# EAGLE design CAN-Bus_Shield_v1.2 (EAGLE 6.5.0)
DESCRIPTION: microOBD 200 OBD-II Module; HW_REV: 1.4; PCB_REV: C; PCB_SPEC1: Layer Count: 4; PCB_SPEC2: Size: 1.3" x 0.59"; PCB_SPEC3: Finish Thickness: 0.049" - 0.052"; PCB_SPEC4: Copper Weight: 1oz; TITLE: STM1120
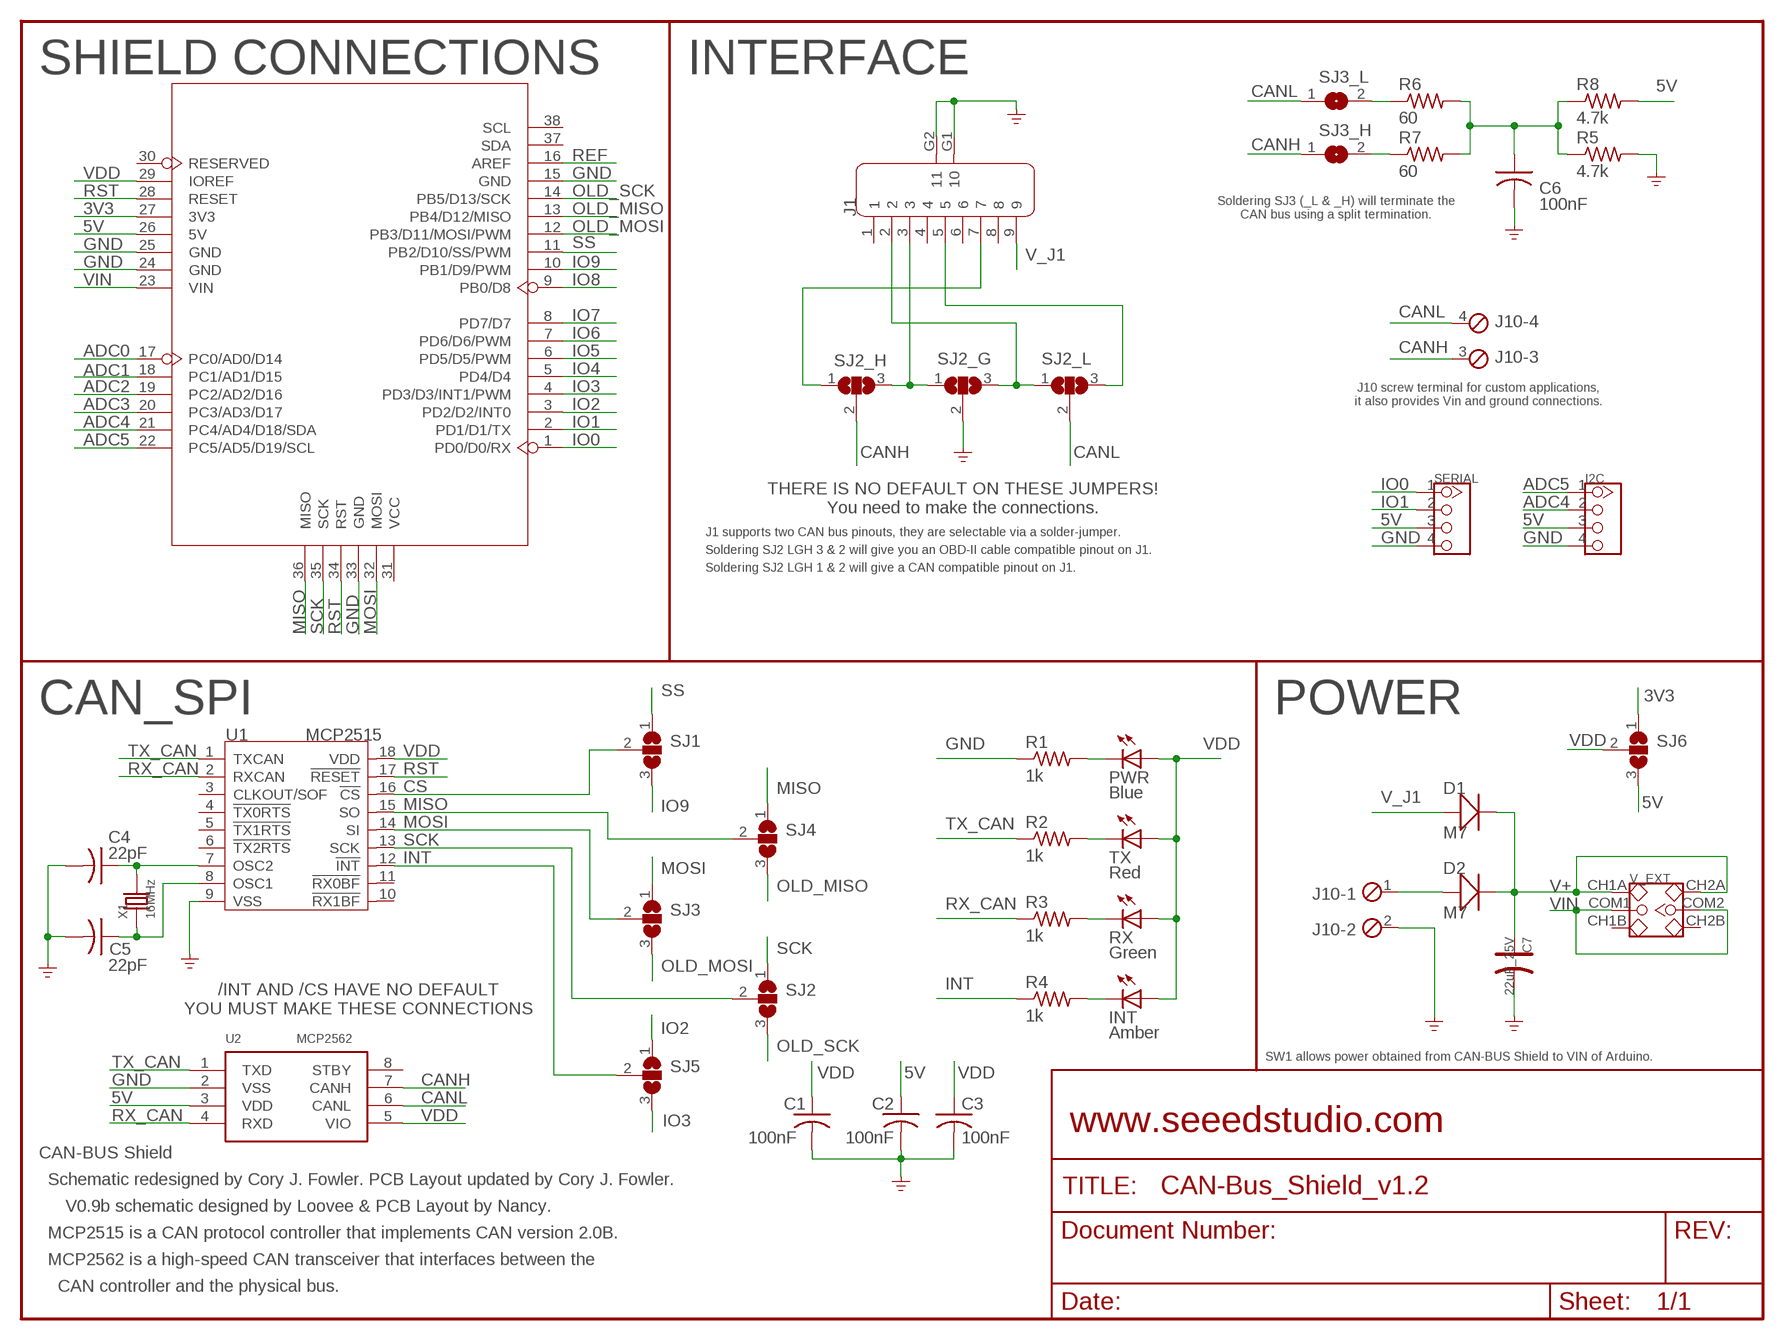
[diagram p0: schematic, sheet 1]

## Parts
C1  100nF  C-USC0603K  [C0603K]
C2  100nF  C-USC0603K  [C0603K]
C3  100nF  C-USC0603K  [C0603K]
C4  22pF  C-USC0603  [C0603]
C5  22pF  C-USC0603  [C0603]
C6  100nF  C-USC1210  [C1210]
C7  22uF_25V  CAP-AVX-C  [AVX-C]
D1  M7  D-SMA  [D2010]
D2  M7  D-SMA  [D2010]
I2C  TWIG-4P-2.0-2.0  [4P-2.0]
INT  Amber  LEDCHIP-LED0805  [CHIP-LED0805]
J1  DB9'MEAL'  [DB9-MEAL]
J10  MPT4  [4POL254]
PWR  Blue  LEDCHIP-LED0805  [CHIP-LED0805]
R1  1k  R-US_M0805  [M0805]
R2  1k  R-US_M0805  [M0805]
R3  1k  R-US_M0805  [M0805]
R4  1k  R-US_M0805  [M0805]
R5  4.7k  R-US_M3216  [M3216]
R6  60  R-US_M3216  [M3216]
R7  60  R-US_M3216  [M3216]
R8  4.7k  R-US_M3216  [M3216]
RX  Green  LEDCHIP-LED0805  [CHIP-LED0805]
SERIAL  TWIG-4P-2.0-2.0  [4P-2.0]
SJ1  SJ2W  [SJ_2]
SJ2  SJ2W  [SJ_2]
SJ2_G  SJ2W  [SJ_2]
SJ2_H  SJ2W  [SJ_2]
SJ2_L  SJ2W  [SJ_2]
SJ3  SJ2W  [SJ_2]
SJ3_H  SJ  [SJ]
SJ3_L  SJ  [SJ]
SJ4  SJ2W  [SJ_2]
SJ5  SJ2W  [SJ_2]
SJ6  SJ2W  [SJ_2]
TX  Red  LEDCHIP-LED0805  [CHIP-LED0805]
U1  MCP2515  [SOIC18]
U2  MCP2562  [SO08]
U3  ARDUINO  [ARDUINO]
V_EXT  SWITCH-2CH-6P  [6P-2CH-2.54-7.6X3.0]
X1  16MHz  CRYSTAL-HC49S  [HC49/S]

## Nets
3V3: SJ6.1 U3.27(3V3)
5V: C2.1 I2C.3 R8.2 SERIAL.3 SJ6.3 U2.3(VDD) U3.26(5V)
ADC0: U3.17(PC0/AD0/D14)
ADC1: U3.18(PC1/AD1/D15)
ADC2: U3.19(PC2/AD2/D16)
ADC3: U3.20(PC3/AD3/D17)
ADC4: I2C.2 U3.21(PC4/AD4/D18/SDA)
ADC5: I2C.1 U3.22(PC5/AD5/D19/SCL)
CANH: J10.3 SJ2_H.2 SJ3_H.1 U2.7(CANH)
CANL: J10.4 SJ2_L.2 SJ3_L.1 U2.6(CANL)
CS: SJ1.2 U1.16(!CS)
GND: C1.2 C2.2 C3.2 C4.2 C5.2 C6.2 C7.- I2C.4 J1.G1 J1.G2 J10.2 R1.1 R5.2 SERIAL.4 SJ2_G.2 U1.9(VSS) U2.2(VSS) U3.15(GND) U3.24(GND) U3.25(GND) U3.33(GND)
INT: R4.1 SJ5.2 U1.12(!INT)
IO0: SERIAL.1 U3.1(PD0/D0/RX)
IO1: SERIAL.2 U3.2(PD1/D1/TX)
IO2: SJ5.1 U3.3(PD2/D2/INT0)
IO3: SJ5.3 U3.4(PD3/D3/INT1/PWM)
IO4: U3.5(PD4/D4)
IO5: U3.6(PD5/D5/PWM)
IO6: U3.7(PD6/D6/PWM)
IO7: U3.8(PD7/D7)
IO8: U3.9(PB0/D8)
IO9: SJ1.3 U3.10(PB1/D9/PWM)
MISO: SJ4.1 SJ4.2 U1.15(SO) U3.36(MISO)
MOSI: SJ3.1 SJ3.2 U1.14(SI) U3.32(MOSI)
N$1: PWR.C R1.2
N$2: R2.2 TX.C
N$3: R3.2 RX.C
N$4: J1.2 SJ2_G.3 SJ2_L.1
N$5: J1.7 SJ2_H.1
N$6: J1.3 SJ2_G.1 SJ2_H.3
N$8: R6.1 SJ3_L.2
N$9: R7.1 SJ3_H.2
N$10: C6.1 R5.1 R6.2 R7.2 R8.1
N$13: C5.1 U1.8(OSC1) X1.1
N$14: C4.1 U1.7(OSC2) X1.2
N$15: INT.C R4.2
N$17: J1.5 SJ2_L.3
OLD_MISO: SJ4.3 U3.13(PB4/D12/MISO)
OLD_MOSI: SJ3.3 U3.12(PB3/D11/MOSI/PWM)
OLD_SCK: SJ2.3 U3.14(PB5/D13/SCK)
REF: U3.16(AREF)
RST: U1.17(!RESET) U3.28(RESET) U3.34(RST)
RX_CAN: R3.1 U1.2(RXCAN) U2.4(RXD)
SCK: SJ2.1 SJ2.2 U1.13(SCK) U3.35(SCK)
SS: SJ1.1 U3.11(PB2/D10/SS/PWM)
TX_CAN: R2.1 U1.1(TXCAN) U2.1(TXD)
V+: C7.+ D1.- D2.- V_EXT.CH1A V_EXT.CH2A
V_J1: D1.+ J1.9
V_J10: D2.+ J10.1
VDD: C1.1 C3.1 INT.A PWR.A RX.A SJ6.2 TX.A U1.18(VDD) U2.5(VIO) U3.29(IOREF)
VIN: U3.23(VIN) V_EXT.COM1 V_EXT.COM2
Unconnected: J1.1 J1.4 J1.6 J1.8 U1.3(CLKOUT/SOF) U1.4(!TX0RTS) U1.5(!TX1RTS) U1.6(!TX2RTS) U1.10(!RX1BF) U1.11(!RX0BF) U2.8(STBY) U3.30(RESERVED) U3.31(VCC) U3.37(SDA) U3.38(SCL) V_EXT.CH1B V_EXT.CH2B

## Notes on the sheet
- SHIELD CONNECTIONS | INTERFACE
- Soldering SJ3 (_L & _H) will terminate the
  CAN bus using a split termination.
- J10 screw terminal for custom applications,
  it also provides Vin and ground connections.
- THERE IS NO DEFAULT ON THESE JUMPERS!
  You need to make the connections.
- J1 supports two CAN bus pinouts, they are selectable via a solder-jumper.
- Soldering SJ2 LGH 3 & 2 will give you an OBD-II cable compatible pinout on J1.
- Soldering SJ2 LGH 1 & 2 will give a CAN compatible pinout on J1.
- CAN_SPI | POWER
- /INT AND /CS HAVE NO DEFAULT
  YOU MUST MAKE THESE CONNECTIONS
- SW1 allows power obtained from CAN-BUS Shield to VIN of Arduino.
- www.seeedstudio.com
- CAN-BUS Shield
- Schematic redesigned by Cory J. Fowler. PCB Layout updated by Cory J. Fowler.
- V0.9b schematic designed by Loovee & PCB Layout by Nancy.
- MCP2515 is a CAN protocol controller that implements CAN version 2.0B.
- MCP2562 is a high-speed CAN transceiver that interfaces between the
- CAN controller and the physical bus.

## Library data of the parts
C1-C6 = resistor:C-US: CAPACITOR, American symbol
C7 = Discrete:CAP*: Electrolytic Capacitors,Tantalum Capacitors and Super Capacitors
D1 D2 = Discrete:D*
I2C SERIAL = Connector:TWIG-4P-2.0
INT PWR RX TX = led:LED: LED OSRAM: - CHIPLED LG R971, LG N971, LY N971, LG Q971, LY Q971, LO R971, LY R971 LH N974, LH R974 LS Q976, LO Q976, LY Q976 LO Q996 - Hyper CHIPLED LW Q18S LB Q993, LB Q99A, LB R99A - SideLED LS A670, LO A670, LY A670, LG A670, LP A670 LB A673, LV A673, LT A673, LW A673 LH A674 LY A675 LS A676, LA A676, LO A676, LY A676, LW A676 LS A679, LY A679, LG A679 - Hyper Micro SIDELED® LS Y876, LA Y876, LO Y876, LY Y876 LT Y87S - SmartLED LW L88C, LW L88S LB L89C, LB L89S, LG L890 LS L89K, LO L89K, LY L89K LS L896, LA L896, LO L896, LY L896 - TOPLED LS T670, LO T670, LY T670, LG T670, LP T670 LSG T670, LSP T670, LSY T670, LOP T670, LYG T670 LG T671, LOG T671, LSG T671 LB T673, LV T673, LT T673, LW T673 LH T674 LS T676, LA T676, LO T676, LY T676, LB T676, LH T676, LSB T676, LW T676 LB T67C, LV T67C, LT T67C, LS T67K, LO T67K, LY T67K, LW E67C LS E67B, LA E67B, LO E67B, LY E67B, LB E67C, LV E67C, LT E67C LW T67C LS T679, LY T679, LG T679 LS T770, LO T770, LY T770, LG T770, LP T770 LB T773, LV T773, LT T773, LW T773 LH T774 LS E675, LA E675, LY E675, LS T675 LS T776, LA T776, LO T776, LY T776, LB T776 LHGB T686 LT T68C, LB T68C - Hyper Mini TOPLED® LB M676 - Mini TOPLED Santana® LG M470 LS M47K, LO M47K, LY M47K Source: http://www.osram.convergy.de LUXEON: - LUMILED® LXK2-PW12-R00, LXK2-PW12-S00, LXK2-PW14-U00, LXK2-PW14-V00 LXK2-PM12-R00, LXK2-PM12-S00, LXK2-PM14-U00 LXK2-PE12-Q00, LXK2-PE12-R00, LXK2-PE12-S00, LXK2-PE14-T00, LXK2-PE14-U00 LXK2-PB12-K00, LXK2-PB12-L00, LXK2-PB12-M00, LXK2-PB14-N00, LXK2-PB14-P00, LXK2-PB14-Q00 LXK2-PR12-L00, LXK2-PR12-M00, LXK2-PR14-Q00, LXK2-PR14-R00 LXK2-PD12-Q00, LXK2-PD12-R00, LXK2-PD12-S00 LXK2-PH12-R00, LXK2-PH12-S00 LXK2-PL12-P00, LXK2-PL12-Q00, LXK2-PL12-R00 Source: www.luxeon.com KINGBRIGHT: KA-3528ASYC Source: www.kingbright.com
J1 = Connector:DB9
J10 = con-phoenix-254:MPT4: PHOENIX CONNECTOR; OC_FARNELL: unknown; OC_NEWARK: unknown
R1-R8 = resistor:R-US_: RESISTOR, American symbol
SJ1 SJ2 SJ2_G SJ2_H SJ2_L SJ3-SJ6 = jumper:SJ2W: SMD solder JUMPER
SJ3_H SJ3_L = jumper:SJ: SMD solder JUMPER
U1 = IC:MCP2515: Stand-Alone CAN Controller With SPI Interface
U2 = IC:MCP2562: High-Speed CAN Transceiver http://ww1.microchip.com/downloads/en/devicedoc/21667f.pdf
U3 = Module:ARDUINO
V_EXT = Discrete:SWITCH-2CH-6P
X1 = Discrete:CRYSTAL*: CRYSTAL

## Net classes
0 default: width 0.203 mm, drill 0.305 mm, clearance 0.203 mm

## Board
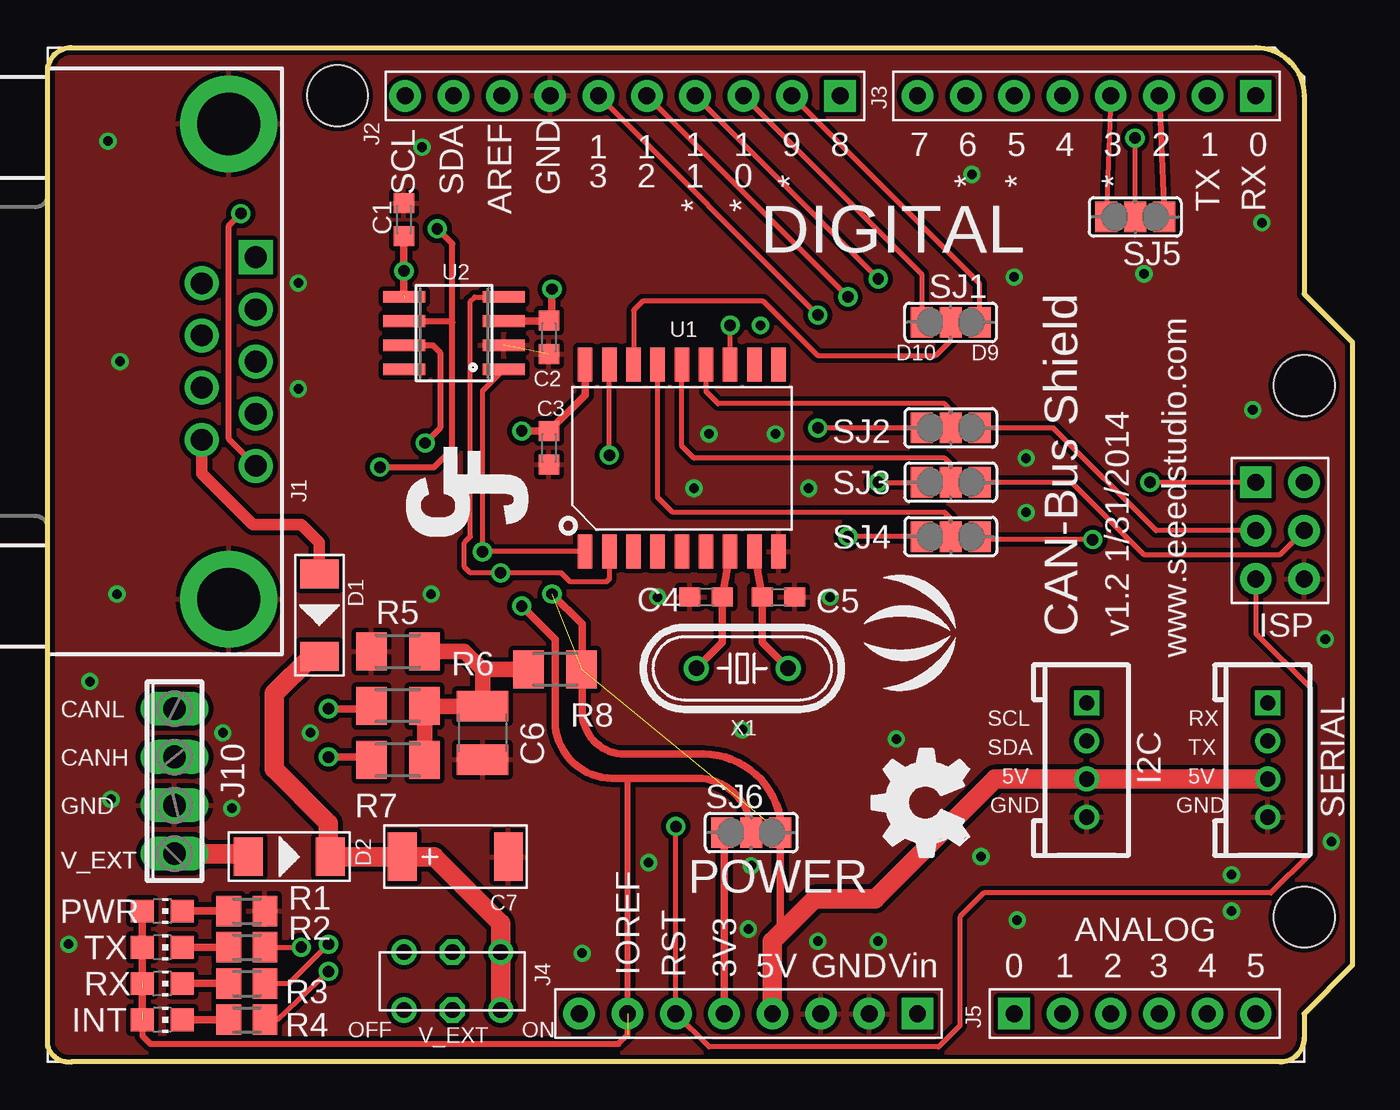
[diagram p1: board, top side]
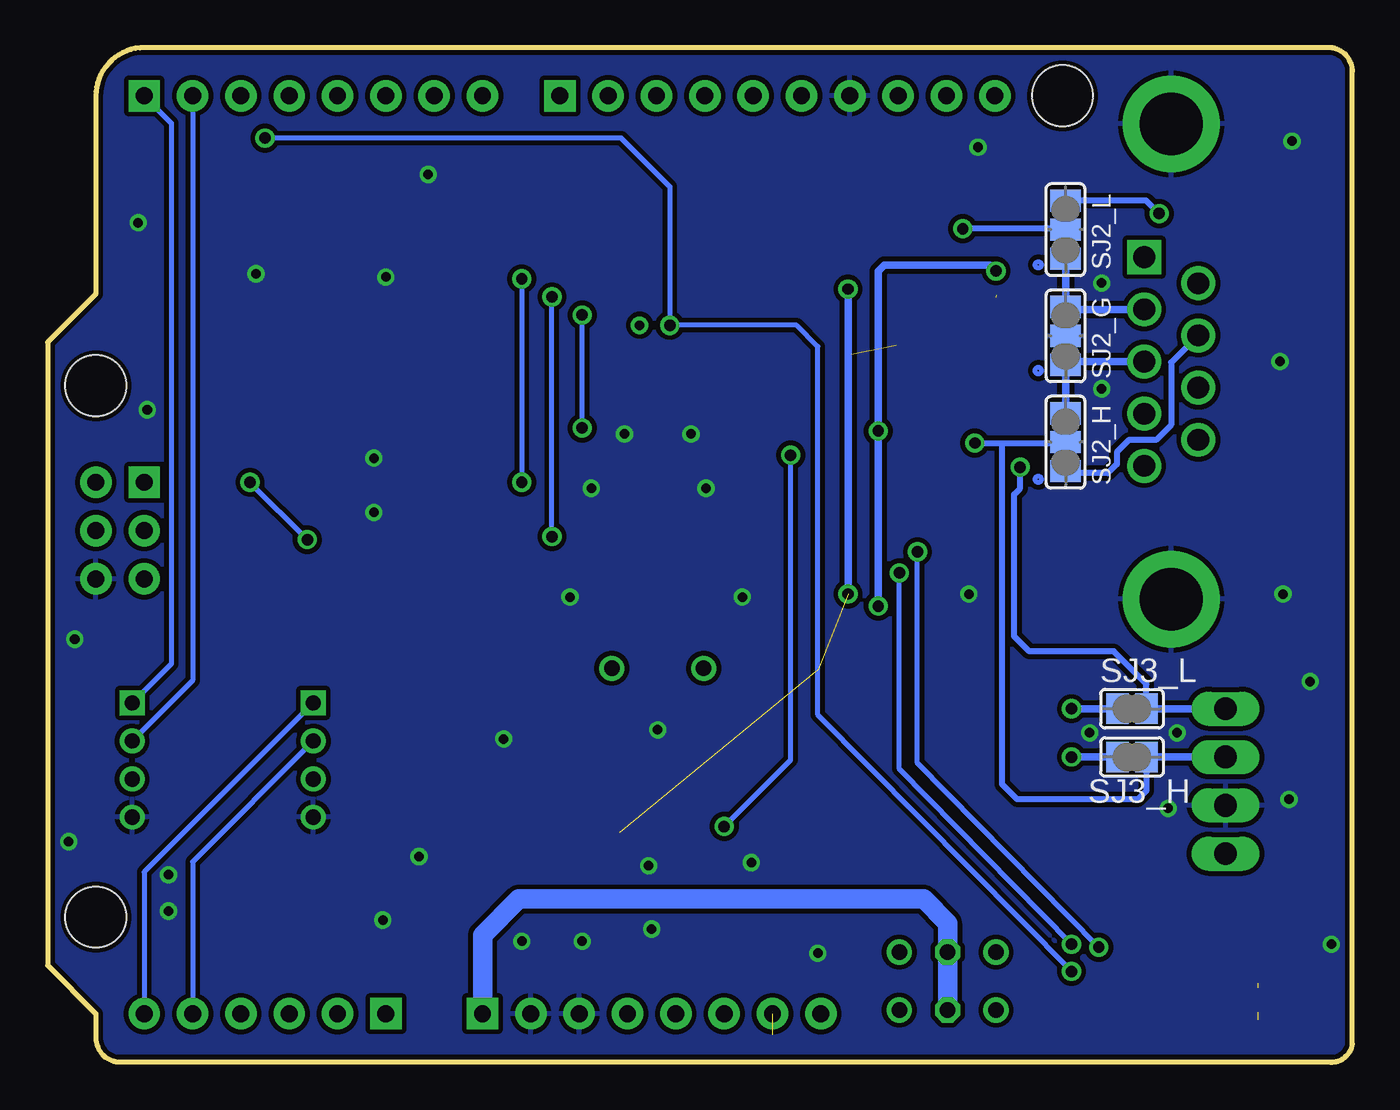
[diagram p2: board, bottom side, seen from below]

Size 68.58 x 53.35 mm. Coordinates in mm from the lower left corner, seen from the top.
Outline: 66.04,2.55 66.04,1.28 arc-90 64.77,0.01 1.27,0.01 arc-90 0,0.96 0,52.08 arc-90 1.27,53.35 63.5,53.35 arc-90 66.04,50.81 66.04,40.4 68.58,37.86 68.58,5.09 66.04,2.55
Copper layers (1*16): Top 0.035mm / dielectric 1.5mm / Bottom 0.035mm
Design rules "default": minimum track width 10mil, minimum drill 12mil, track to track 8mil, track to pad 8mil, pad to pad 8mil, via to via 8mil, smd to smd 8mil, copper to edge 10mil, drill to drill 8mil, minimum pad ring 10mil, minimum via ring 8mil, stop-mask expansion 4mil, vias tented up to drill 25mil, thermal gap 10mil

### Footprints (pad centres in the part's own frame; a part is rotated, then mirrored left to right if it is on the bottom)
C0603K = smd 1.05 x 1.08: 1 -0.875,0; 2 0.875,0
C0603 = smd 1.1 x 1: 1 -0.85,0; 2 0.85,0
C1210 = smd 1.6 x 2.7: 1 -1.4,0; 2 1.4,0
AVX-C = smd 1.524 x 2.54: + -2.794,0; - 2.794,0
D2010 = smd 1.524 x 2.032: + -2.159,0; - 2.159,0
4P-2.0 = drill 0.8 pad 1.27 square: 1 -3,0 | drill 0.8 pad 1.27: 2 -1,0; 3 1,0; 4 3,0
CHIP-LED0805 = smd 1.2 x 1.2: A 0,-1.05; C 0,1.05
DB9-MEAL = drill 1.143 pad 1.778 square: 1 -5.486,1.422 | drill 1.143 pad 1.778: 2 -2.743,1.422; 3 0,1.422; 4 2.743,1.422; 5 5.486,1.422; 6 -4.115,-1.422; 7 -1.372,-1.422; 8 1.372,-1.422; 9 4.115,-1.422 | drill 3.302 pad 5.08: G1 12.497,0; G2 -12.497,0
4POL254 = drill 1.2 long: 1 -3.81,0; 2 -1.27,0; 3 1.27,0; 4 3.81,0
M0805 = smd 1.3 x 1.6: 1 -0.95,0; 2 0.95,0
M3216 = smd 1.6 x 2: 1 -1.4,0; 2 1.4,0
SJ_2 = smd 1.168 x 1.6: 1 -1.524,0; 2 0,0; 3 1.524,0
SJ = smd 1.168 x 1.6: 1 -0.762,0; 2 0.762,0
SOIC18 = smd 0.762 x 1.778: 1 -5.08,-4.915; 2 -3.81,-4.915; 3 -2.54,-4.915; 4 -1.27,-4.915; 5 0,-4.915; 6 1.27,-4.915; 7 2.54,-4.915; 8 3.81,-4.915; 9 5.08,-4.915; 10 5.08,4.915; 11 3.81,4.915; 12 2.54,4.915; 13 1.27,4.915; 14 0,4.915; 15 -1.27,4.915; 16 -2.54,4.915; 17 -3.81,4.915; 18 -5.08,4.915
SO08 = smd 0.61 x 2.21: 1 -1.905,-2.616; 2 -0.635,-2.616; 3 0.635,-2.616; 4 1.905,-2.616; 5 1.905,2.616; 6 0.635,2.616; 7 -0.635,2.616; 8 -1.905,2.616
ARDUINO = drill 0.889 pad 1.651 square: 1 63.5,50.8; 9 41.656,50.8; 17 50.8,2.54; 23 45.72,2.54; 36 63.5,30.48 | drill 0.889 pad 1.651: 2 60.96,50.8; 3 58.42,50.8; 4 55.88,50.8; 5 53.34,50.8; 6 50.8,50.8; 7 48.26,50.8; 8 45.72,50.8; 10 39.116,50.8; 11 36.576,50.8; 12 34.036,50.8; 13 31.496,50.8; 14 28.956,50.8; 15 26.416,50.8; 16 23.876,50.8; 18 53.34,2.54; 19 55.88,2.54; 20 58.42,2.54; 21 60.96,2.54; 22 63.5,2.54; 24 43.18,2.54; 25 40.64,2.54; 26 38.1,2.54; 27 35.56,2.54; 28 33.02,2.54; 29 30.48,2.54; 30 27.94,2.54; 31 66.04,30.48; 32 66.04,27.94; 33 66.04,25.4; 34 63.5,25.4; 35 63.5,27.94; 37 21.336,50.8; 38 18.796,50.8 | hole 3.2: 15.24,50.8; 66.04,35.56; 66.04,7.62
6P-2CH-2.54-7.6X3.0 = drill 0.813 pad 1.27: CH1A -1.524,2.54; CH1B -1.524,-2.54; CH2A 1.524,2.54; CH2B 1.524,-2.54 | drill 0.813 pad 1.27 octagon: COM1 -1.524,0; COM2 1.524,0
HC49/S = drill 0.813: 1 -2.413,0; 2 2.413,0

### Placement (x,y rotation side)
C1  18.73,44.3 90 top
C2  26.35,38.11 270 top
C3  26.35,32.3 270 top
C4  34.61,24.46 180 top
C5  38.42,24.46 0 top
C6  22.86,17.31 270 top
C7  21.43,10.81 0 top
D1  14.29,23.51 270 top
D2  12.7,10.81 0 top
I2C  54.61,15.89 270 top
INT  6.03,2.23 270 top
J1  9.53,36.84 270 top
J10  6.67,14.77 90 top
PWR  6.03,7.95 270 top
R1  10.48,7.95 180 top
R2  10.48,6.04 180 top
R3  10.48,4.14 180 top
R4  10.48,2.23 180 top
R5  18.41,21.6 180 top
R6  18.41,18.74 0 top
R7  18.41,15.89 0 top
R8  26.67,20.65 0 top
RX  6.03,4.14 270 top
SERIAL  64.14,15.89 270 top
SJ1  47.47,38.9 0 top
SJ2  47.47,33.35 180 top
SJ2_G  15.07,38.19 90 bottom
SJ2_H  15.08,32.6 90 bottom
SJ2_L  15.08,43.78 90 bottom
SJ3  47.47,30.49 180 top
SJ3_H  11.59,16.04 180 bottom
SJ3_L  11.59,18.58 180 bottom
SJ4  47.47,27.63 180 top
SJ5  57.16,44.44 180 top
SJ6  36.99,12.08 0 top
TX  6.03,6.04 270 top
U1  33.34,31.76 0 top
U2  21.37,38.33 90 top
U3  0,0.01 0 top
U$1  [LOGO_SILK]  46.04,22.55 90 top
U$2  [OSHW_FILLX200_NOTEXT]  48.42,10.81 90 top
U$9  [CJF]  25.56,27.32 90 top
V_EXT  21.27,4.26 270 top
X1  36.51,20.71 180 top

### Tracks (layer width: path | path; a pad name or v marks a point on that pad's centre or on a via)
3V3
  Top 0.406: U3.27 35.56,11.98 SJ6.1
5V  (via drill 0.6 pad 0.81)  (2 unrouted)
  Top 0.254: 38.1,6.36 38.51,6.77
  Top 0.406: U2.3 26.34,38.97 C2.1 26.51,39.14 v26.51,40.65 | 38.51,6.77 SJ6.3
  Top 1.016: SERIAL.3 I2C.3 49.8,14.89 43.5,8.58 40.32,8.58 38.1,6.36 U3.26
  Bottom 0.406: v26.51,24.62 v26.51,40.65
ADC4
  Bottom 0.254: I2C.2 60.96,10.54 U3.21
ADC5
  Bottom 0.254: I2C.1 63.5,10 U3.22
CANH  (via drill 0.6 pad 0.41)
  Top 0.305: U2.7 20.26,37.7 20.64,37.32 20.64,33.35 v19.84,32.55
  Bottom 0.305: SJ3_H.1 10.83,14.27 11.27,13.82 17.62,13.82 18.41,14.62 18.41,32.55 | 18.41,32.55 15.12,32.55 SJ2_H.2 | v19.84,32.55 18.41,32.55
  Bottom 0.406: J10.3 SJ3_H.1
CANL  (via drill 0.6 pad 0.41)
  Top 0.305: v17.46,31.28 20.32,31.28 21.27,32.24 21.27,38.9 | 21.27,38.9 21.27,43.03 v20.48,43.83 | U2.6 21.21,38.97 21.27,38.9
  Bottom 0.305: SJ3_L.1 10.83,19.89 12.54,21.6 16.99,21.6 17.78,22.39 17.78,29.86 17.46,30.17 v17.46,31.28 | v20.48,43.83 15.13,43.83 SJ2_L.2
  Bottom 0.406: J10.4 SJ3_L.1
CS
  Top 0.254: U1.16 30.8,39.54 31.27,40.02 37.62,40.02 40.48,37.16 46.67,37.16 47.47,37.95 SJ1.2
GND  (via drill 0.5)  (1 unrouted)
  other vias: 36.99,10.33 36.83,7 33.97,30.17 34.77,33.03 38.26,33.03 40.01,30.17 51.44,28.9 51.44,31.76 13.18,35.41 13.18,40.97 13.81,17.31 9.21,17.31 67.15,22.24 62.23,7.95 62.23,9.85 49.05,10.81 50.96,7.47 43.66,6.36 28.1,5.73 31.59,10.49 36.51,17.47 41.12,24.46 32.07,24.46 63.34,34.3 57.63,41.44 63.82,44.14 48.58,46.68 19.68,48.11 3.17,48.43 3.81,36.84 3.65,24.62 9.68,13.35 3.33,13.82 67.47,11.6 50.8,41.29 44.61,17 20.16,24.62 2.22,20.01 1.11,6.2 40.48,6.36
  pour Top (isolate 0.254): 0,53.35 68.58,53.35 68.58,0.01 0,0.01
  pour Bottom (isolate 0.254): 0,53.35 68.58,53.35 68.58,0.01 0,0.01
INT  (via drill 0.6, 0.6 pad 0.81)
  Top 0.254: U1.12 v35.88,38.75 | R4.1 12.06,2.23 v14.76,4.77 | v57.15,48.59 SJ5.2
  Top 0.406: SJ5.2
  Bottom 0.254: v14.76,4.77 28.1,18.27 28.1,37.63 29.21,38.75 v35.88,38.75 35.88,46.05 38.42,48.59 v57.15,48.59
IO0
  Bottom 0.254: U3.1 62.07,49.38 62.07,20.95 SERIAL.1
IO1
  Bottom 0.254: U3.2 60.96,20.06 SERIAL.2
IO2
  Top 0.305: U3.3 SJ5.1
IO3
  Top 0.254: U3.4 SJ5.3
IO9
  Top 0.254: SJ1.3 48.99,40.94 U3.10
MISO  (via drill 0.6 pad 0.41)
  Top 0.254: U1.15 32.07,29.7 32.86,28.9 47.15,28.9 47.47,28.59 SJ4.2 SJ4.1 49.15,27.47 v54.93,27.47 | U3.36 v57.94,30.49
  Bottom 0.254: v57.94,30.49 v54.93,27.47
MOSI
  Top 0.254: U3.32 64.77,26.68 57.63,26.68 53.82,30.49 SJ3.1 SJ3.2 47.47,31.44 47.15,31.76 33.97,31.76 33.34,32.4 U1.14
N$1
  Top 0.406: 9.37,8.11 R1.2 PWR.C
N$2
  Top 0.406: R2.2 TX.C
N$3
  Top 0.406: RX.C R3.2
N$4
  Bottom 0.406: J1.2 14.95,39.58 SJ2_G.3 SJ2_L.1
N$5
  Bottom 0.305: J1.7 9.53,36.79 9.53,33.51 10.32,32.71 11.75,32.71 12.38,32.08 12.38,31.44 12.86,30.97 14.97,30.97 SJ2_H.1
N$6
  Bottom 0.406: J1.3 14.9,36.84 SJ2_G.1 SJ2_H.3
N$8  (via drill 0.6 pad 0.41)
  Top 0.406: v14.76,18.58 16.86,18.58 R6.1
  Bottom 0.406: SJ3_L.2 v14.76,18.58
N$9  (via drill 0.6 pad 0.41)
  Top 0.406: v14.76,16.04 16.86,16.04 R7.1
  Bottom 0.406: SJ3_H.2 v14.76,16.04
N$10
  Top 0.813: 19.82,15.91 R7.2 R6.2 19.84,18.71 C6.1 22.86,20.65 | R5.1 21.91,21.6 22.86,20.65 | 22.86,20.65 R8.1
N$12
  Top 0.406: 38.58,12.08 arc90 34.45,16.2 30.32,16.2 | 30.32,16.2 30.16,16.2 | 28.1,18.27 28.1,18.43 | 28.1,18.43 28.1,23.03 26.51,24.62 | 30.32,16.2 arc-90 28.1,18.43
N$13
  Top 0.406: U1.8 C5.1 37.57,22.07 X1.1
N$14
  Top 0.406: U1.7 C4.1 35.46,22.07 X1.2
N$15
  Top 0.406: INT.C R4.2
N$17  (via drill 0.6 pad 0.41)
  Top 0.305: J1.5 9.53,32.78 9.53,43.98 v10.16,44.62
  Bottom 0.305: v10.16,44.62 10.84,45.3 SJ2_L.3
N$26  (via drill 0.5)
  other vias: 37.47,38.75
OLD_MISO  (via drill 0.6 pad 0.81)
  Top 0.254: SJ4.3 v42.07,27.63 | v42.07,40.24 U3.13
  Bottom 0.254: v42.07,27.63 v42.07,40.24
OLD_MOSI  (via drill 0.6 pad 0.81)
  Top 0.254: v43.66,30.49 SJ3.3 | v43.66,41.19 U3.12
  Bottom 0.254: v43.66,41.19 v43.66,30.49
OLD_SCK  (via drill 0.6 pad 0.81)
  Top 0.254: SJ2.3 v40.48,33.35 | v40.48,39.29 U3.14
  Bottom 0.254: v40.48,33.35 v40.48,39.29
RST  (via drill 0.6 pad 0.81)
  Top 0.254: v33.02,12.39 U3.28 34.77,0.8 46.83,0.8 47.94,1.92 47.94,7.63 49.21,8.9 64.29,8.9 66.36,10.96 66.36,19.7 63.5,22.55 U3.34 | v29.53,31.92 U1.17
  Bottom 0.254: v33.02,12.39 29.53,15.89 v29.53,31.92
RX_CAN  (via drill 0.6 pad 0.81)
  Top 0.254: U1.2 29.53,25.41 29.37,25.25 27.46,25.25 26.99,25.73 v23.81,25.73 22.23,25.73 21.91,26.05 21.91,27.32 22.23,27.63 22.23,40.02 22.45,40.24 U2.4 | R3.1 12.7,4.14 v14.76,6.2
  Bottom 0.254: v14.76,6.2 23.81,15.41 v23.81,25.73
SCK
  Top 0.254: U3.35 58.26,27.95 52.86,33.35 SJ2.1 SJ2.2 47.47,34.3 47.15,34.62 35.24,34.62 34.61,35.25 U1.13
SS
  Top 0.254: U3.11 45.94,41.44 SJ1.1
TX_CAN  (via drill 0.6 pad 0.81)
  Top 0.254: R2.1 v13.34,6.04 | 23.97,36.42 U2.1 22.86,35.3 v22.86,26.84 U1.1
  Bottom 0.254: v13.34,6.04 22.86,15.73 v22.86,26.84
V+
  Top 0.813: D1.- 13.88,21.35 | 14.76,10.9 D2.-
  Top 1.016: V_EXT.CH2A V_EXT.CH1A 23.81,7.31 20.32,10.81 C7.+ D2.- | 13.88,21.35 11.91,19.38 11.91,15.41 14.76,12.55 14.76,10.9
V_J1
  Top 0.61: D1.+ 14.29,27.32 13.34,28.27 10.79,28.27 8.1,30.96 J1.9
V_J10
  Top 1.016: J10.1 10.38,10.96 D2.+
VDD  (via drill 0.6, 0.6 pad 0.81)  (4 unrouted)
  Top 0.305: 24.92,33.18 v24.92,33.19 | INT.A 4.98,1.38 5.4,0.96 30,0.96 30.48,1.44 30.48,14.93
  Top 0.406: U1.18 28.26,35.08 C3.1 24.92,33.18 | 18.73,40.33 v18.73,41.6 C1.1 | PWR.A TX.A RX.A | 4.99,2.63 4.99,3.9 | SJ6.2 arc90 34.13,14.93 30.48,14.93 29.69,14.93 arc-90 26.67,17.95 26.67,22.24 v24.92,23.98
  Bottom 0.406: v24.92,23.98 v24.92,33.19 24.92,41.6 24.61,41.92 19.05,41.92 v18.73,41.6
VIN
  Bottom 1.016: V_EXT.COM2 V_EXT.COM1 21.27,7.31 22.54,8.58 43.81,8.58 45.72,6.68 U3.23
(copper drawn outside any net)
  shapes: Bottom circle x3

### Text on the board
tPlace: J3 | J2 | D10 | D9 | CAN-Bus Shield | v1.2 1/31/2014 | www.seeedstudio.com | CANL | SCL | RX | CANH | SDA | TX | 5V | 5V | GND | GND | GND | V_EXT | V_EXT | J4 | J5 | OFF | ON
tNames: ISP